# EasyEDA schematic SCH_Roboliga2026_TOP_2026-04-12.json
TITLE: Placa TOP Robocup Soocer 2026; REV: 1.0; Date: 2026-04-08; Sheet: 1/1; Drawn By: enzzo195; Company: IITA
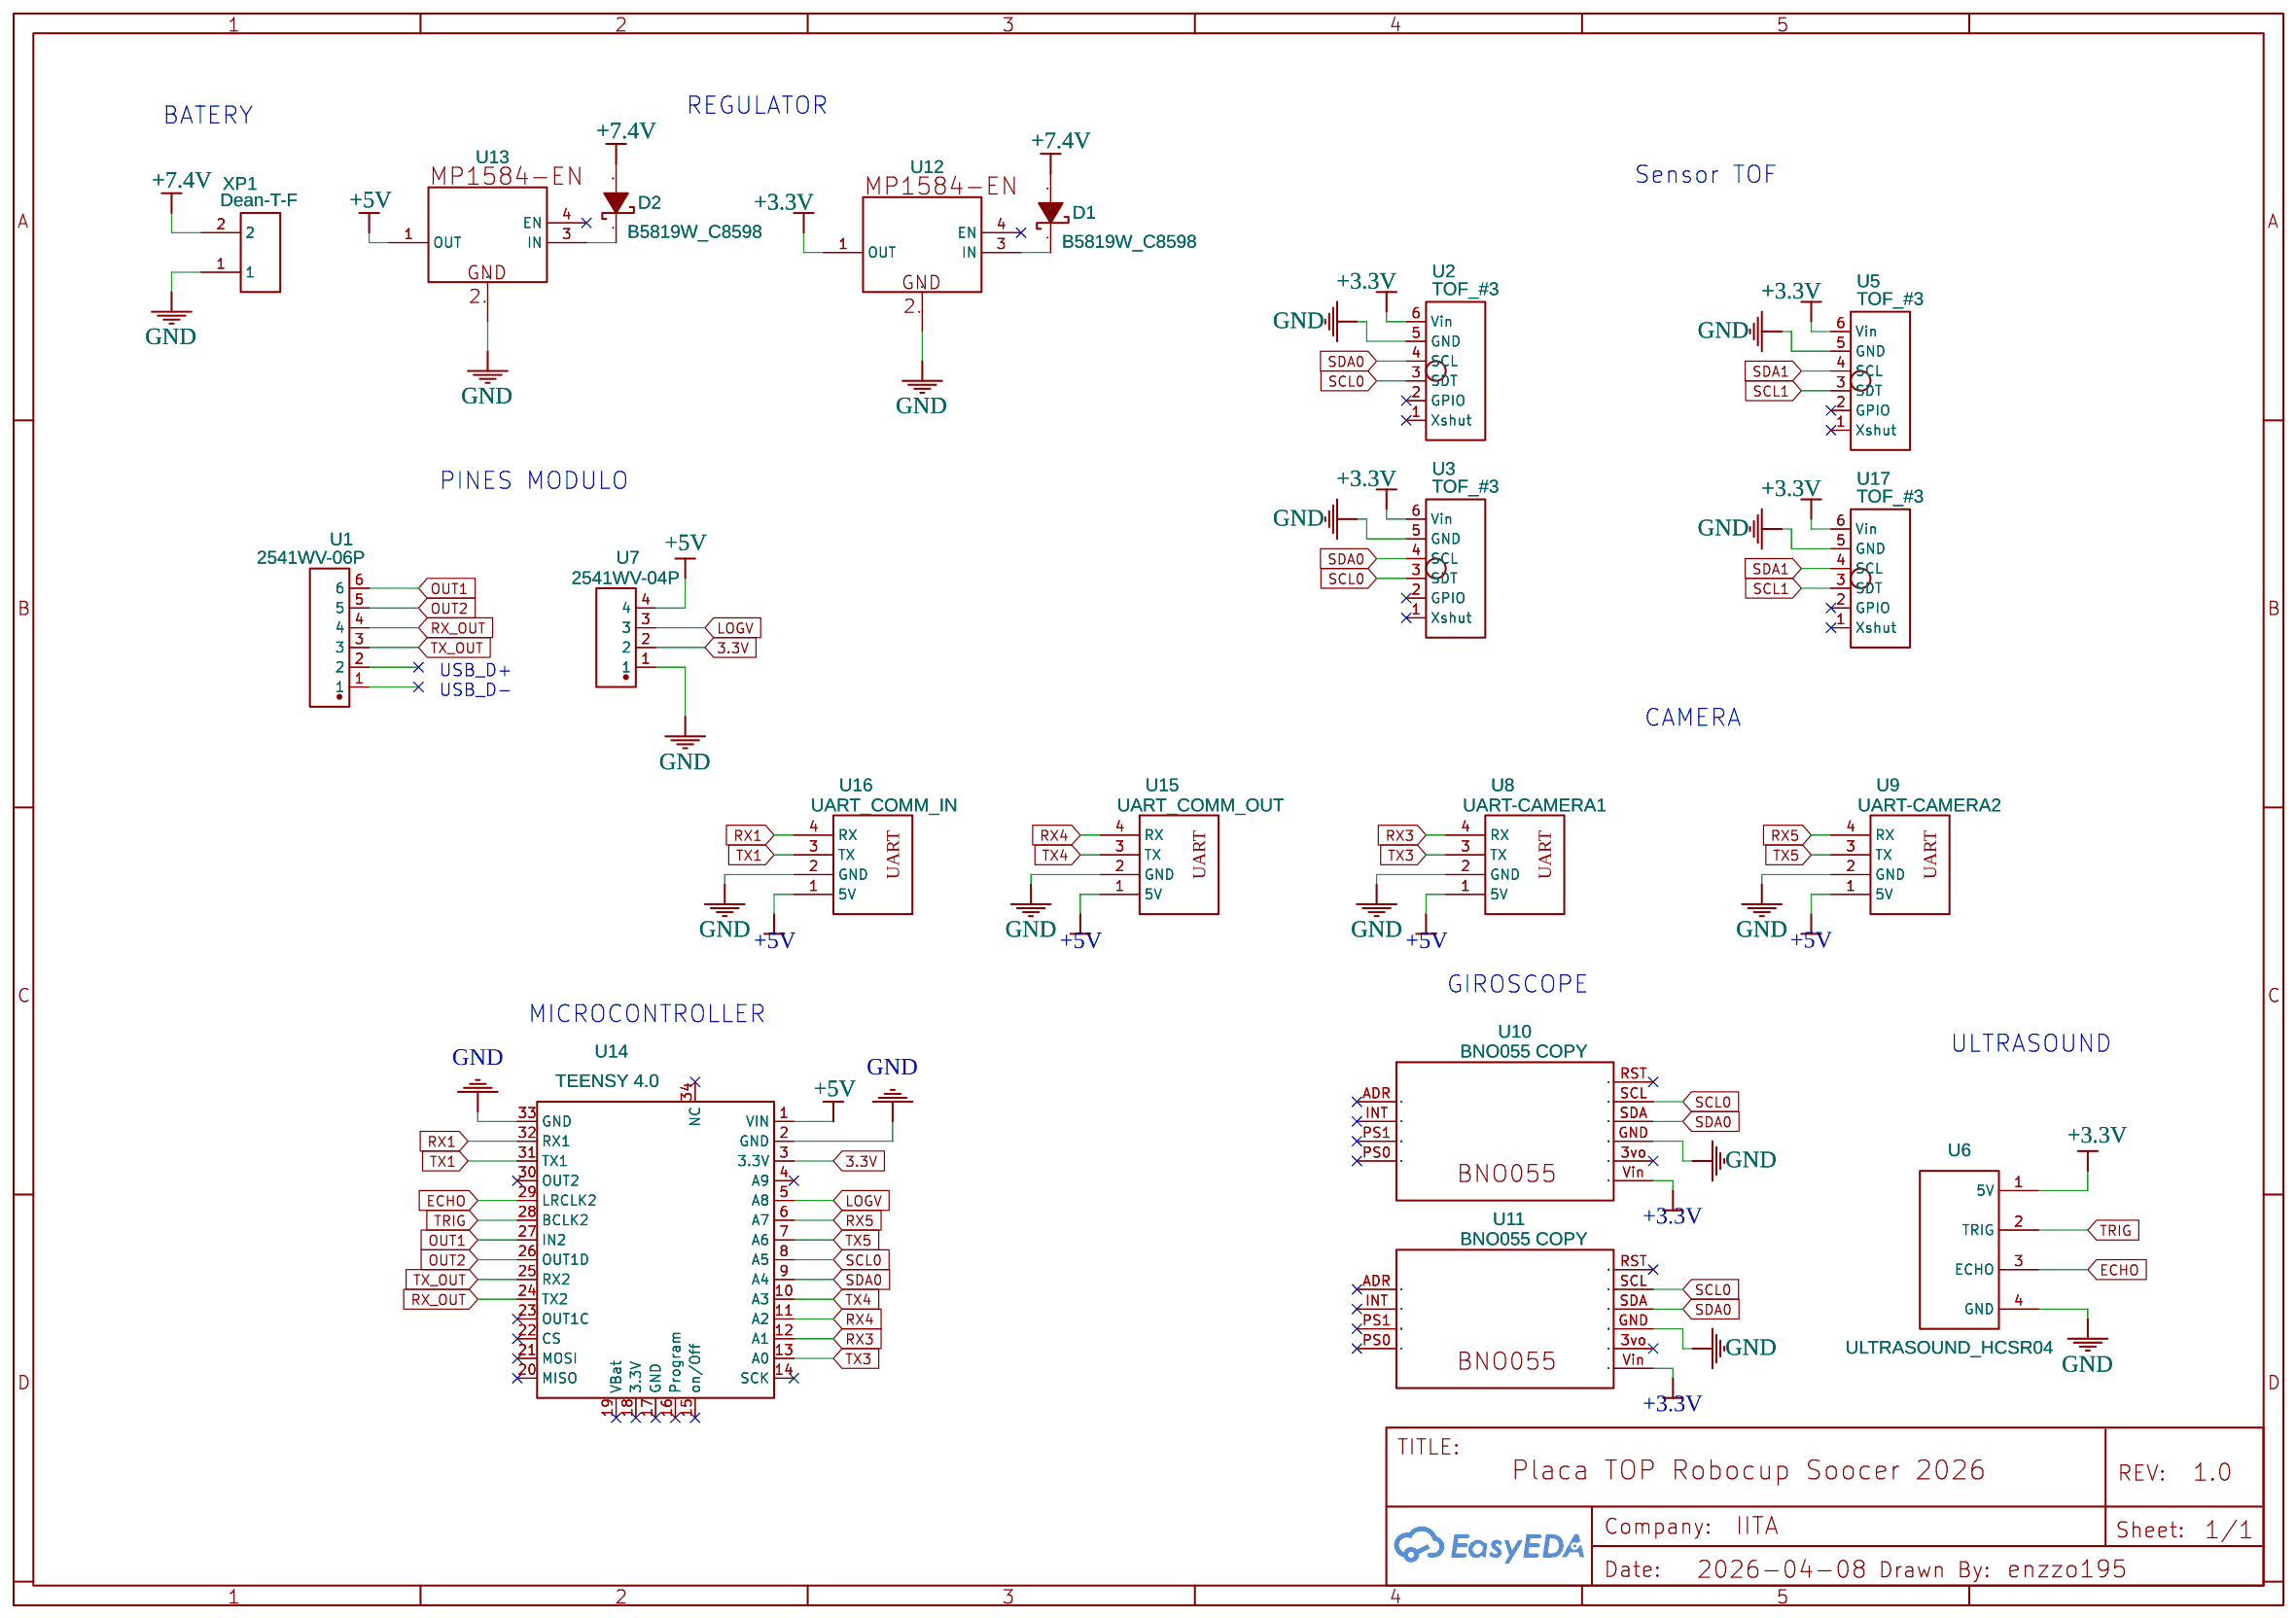
[diagram p0: schematic sheet]

## Parts
D1  B5819W_C8598  [SOD-123_L2.7-W1.6-LS3.7-RD-1]
D2  B5819W_C8598  [SOD-123_L2.7-W1.6-LS3.7-RD-1]
U1  2541WV-06P  [HDR-TH_6P-P2.54-V-M]
U2  TOF_#3  [TOF_#3]
U3  TOF_#3  [TOF_#3]
U5  TOF_#3  [TOF_#3]
U6  ULTRASOUND_HCSR04  [HUELLA_HCSR04]
U7  2541WV-04P  [HDR-TH_4P-P2.54-V-M-1]
U8  UART-CAMERA1  [UART]
U9  UART-CAMERA2  [UART]
U10  BNO055 COPY  [BNO055]
U11  BNO055 COPY  [BNO055]
U12  MP1584EN 4-Pin SIP Module  [MP1584EN-MINI-4-PIN]
U13  MP1584EN 4-Pin SIP Module  [MP1584EN-MINI-4-PIN]
U14  TEENSY 4.0  [COMM-TH_34P-L35.6-W17.8-P2.54_C9900133251]
U15  UART_COMM_OUT  [UART]
U16  UART_COMM_IN  [UART]
U17  TOF_#3  [TOF_#3]
XP1  Dean-T-F  [DEAN-T-F]

## Library data of the parts
D1 D2 = B5819W_C8598: Supplier: LCSC; Manufacturer: CJ(江苏长电/长晶); Manufacturer Part: B5819W SL; Supplier Part: C8598; JLCPCB Part Class: Basic Part
U1 = 2541WV-06P: Contributor: lcsc; Supplier: LCSC; Supplier Part: C5383115; Manufacturer: HanElectricity(瀚源); JLCPCB Part Class: Extended Part
U2 U3 U5 U17 = TOF_#3: Contributor: amirb
U6 = SIMBOLO_HCSR04: Contributor: oswaldo.cuaresma.h
U7 = 2541WV-04P: Contributor: lcsc; Supplier: LCSC; Supplier Part: C5383113; Manufacturer: HanElectricity(瀚源); JLCPCB Part Class: Extended Part
U8 U9 U15 U16 = UART: Contributor: dipin
U10 U11 = BNO055 COPY: Contributor: abdussamet28051999
U12 U13 = MP1584EN 4-Pin SIP Module: Contributor: obadiah.grotts
U14 = TEENSY 4.0: Supplier: LCSC; Supplier Part: C9900133251; Manufacturer: null; Manufacturer Part: Teensy 4.0; JLCPCB Part Class: Extended Part; Contributor: lcsc
XP1 = Dean-T-F: Contributor: irina.grishkovets22101999

## Nets
3.3V: U7.2 U14.3(3.3V)
+3.3V: U2.6(Vin) U3.6(Vin) U5.6(Vin) U6.1(5V) U10.Vin U11.Vin U12.1(OUT) U17.6(Vin)
+5V: U7.4 U8.1(5V) U9.1(5V) U13.1(OUT) U14.1(VIN) U15.1(5V) U16.1(5V)
+7.4V: D1.2(+) D2.2(+) XP1.2
GND: U2.5(GND) U3.5(GND) U5.5(GND) U6.4(GND) U7.1 U8.2(GND) U9.2(GND) U10.GND U11.GND U12.2(GND) U13.2(GND) U14.2(GND) U14.33(GND) U15.2(GND) U16.2(GND) U17.5(GND) XP1.1
ECHO: U6.3(ECHO) U14.29(LRCLK2)
LOGV: U7.3 U14.5(A8)
OUT1: U1.6 U14.27(IN2)
OUT2: U1.5 U14.26(OUT1D)
RX1: U14.32(RX1) U16.4(RX)
RX3: U8.4(RX) U14.12(A1)
RX4: U14.11(A2) U15.4(RX)
RX5: U9.4(RX) U14.6(A7)
RX_OUT: U1.4 U14.24(TX2)
SCL0: U2.3(SDT) U3.3(SDT) U10.SCL U11.SCL U14.8(A5)
SCL1: U5.3(SDT) U17.3(SDT)
SDA0: U2.4(SCL) U3.4(SCL) U10.SDA U11.SDA U14.9(A4)
SDA1: U5.4(SCL) U17.4(SCL)
TRIG: U6.2(TRIG) U14.28(BCLK2)
TX1: U14.31(TX1) U16.3(TX)
TX3: U8.3(TX) U14.13(A0)
TX4: U14.10(A3) U15.3(TX)
TX5: U9.3(TX) U14.7(A6)
TX_OUT: U1.3 U14.25(RX2)
Net-(D1-1): D1.1(-) U12.3(IN)
Net-(D2-1): D2.1(-) U13.3(IN)

Not connected (* = marked no-connect by the designer): U1 1 2; U2 1(Xshut)* 2(GPIO)*; U3 1(Xshut)* 2(GPIO)*; U5 1(Xshut)* 2(GPIO)*; U10 3vo* ADR* INT* PS0* PS1* RST*; U11 3vo* ADR* INT* PS0* PS1* RST*; U12 4(EN)*; U13 4(EN)*; U14 4(A9)* 14(SCK)* 15(on/Off)* 16(Program)* 17(GND)* 18(3.3V)* 19(VBat)* 20(MISO)* 21(MOSI)* 22(CS)* 23(OUT1C)* 30(OUT2)* 34(NC)*; U17 1(Xshut)* 2(GPIO)*

## Notes on the sheet
- BATERY
- REGULATOR
- Sensor TOF
- PINES MODULO
- USB_D+
- USB_D-
- CAMERA
- GIROSCOPE
- MICROCONTROLLER
- ULTRASOUND
